# EAGLE design MagnetCard (EAGLE 9.4.2)
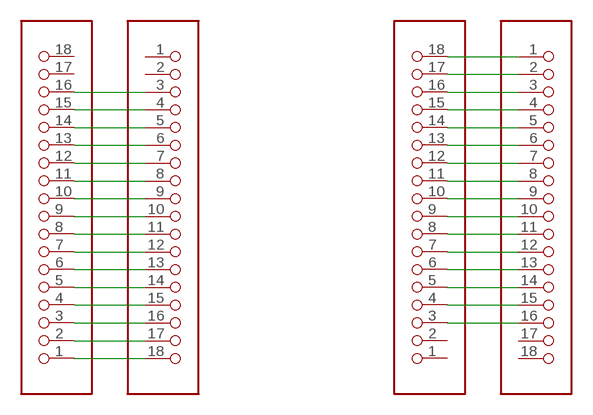
[diagram p0: schematic, sheet 1]

## Parts
U$1  18X1_CARD_PADLONG  [18X1_CARDPAD_LONG]
U$2  18X1_CARD_PADLONG  [18X1_CARDPAD_LONG]
U$3  18X1_CARD_PADLONG  [18X1_CARDPAD_LONG]
U$4  18X1_CARD_PADLONG  [18X1_CARDPAD_LONG]

## Nets
N$1: U$1.18 U$2.1
N$2: U$1.17 U$2.2
N$3: U$1.16 U$2.3
N$4: U$1.15 U$2.4
N$5: U$1.14 U$2.5
N$6: U$1.13 U$2.6
N$7: U$1.12 U$2.7
N$8: U$1.11 U$2.8
N$9: U$1.10 U$2.9
N$10: U$1.9 U$2.10
N$11: U$1.8 U$2.11
N$12: U$1.7 U$2.12
N$13: U$1.6 U$2.13
N$14: U$1.5 U$2.14
N$15: U$1.4 U$2.15
N$16: U$1.3 U$2.16
N$17: U$3.16 U$4.3
N$18: U$3.15 U$4.4
N$19: U$3.14 U$4.5
N$20: U$3.13 U$4.6
N$21: U$3.12 U$4.7
N$22: U$3.11 U$4.8
N$23: U$3.10 U$4.9
N$24: U$3.9 U$4.10
N$25: U$3.8 U$4.11
N$26: U$3.7 U$4.12
N$27: U$3.6 U$4.13
N$28: U$3.5 U$4.14
N$29: U$3.4 U$4.15
N$30: U$3.3 U$4.16
N$31: U$3.2 U$4.17
N$32: U$3.1 U$4.18
Unconnected: U$1.1 U$1.2 U$2.17 U$2.18 U$3.17 U$3.18 U$4.1 U$4.2

## Library data of the parts
U$1-U$4 = EzerLonginus:18X1_CARD_PAD

## Board
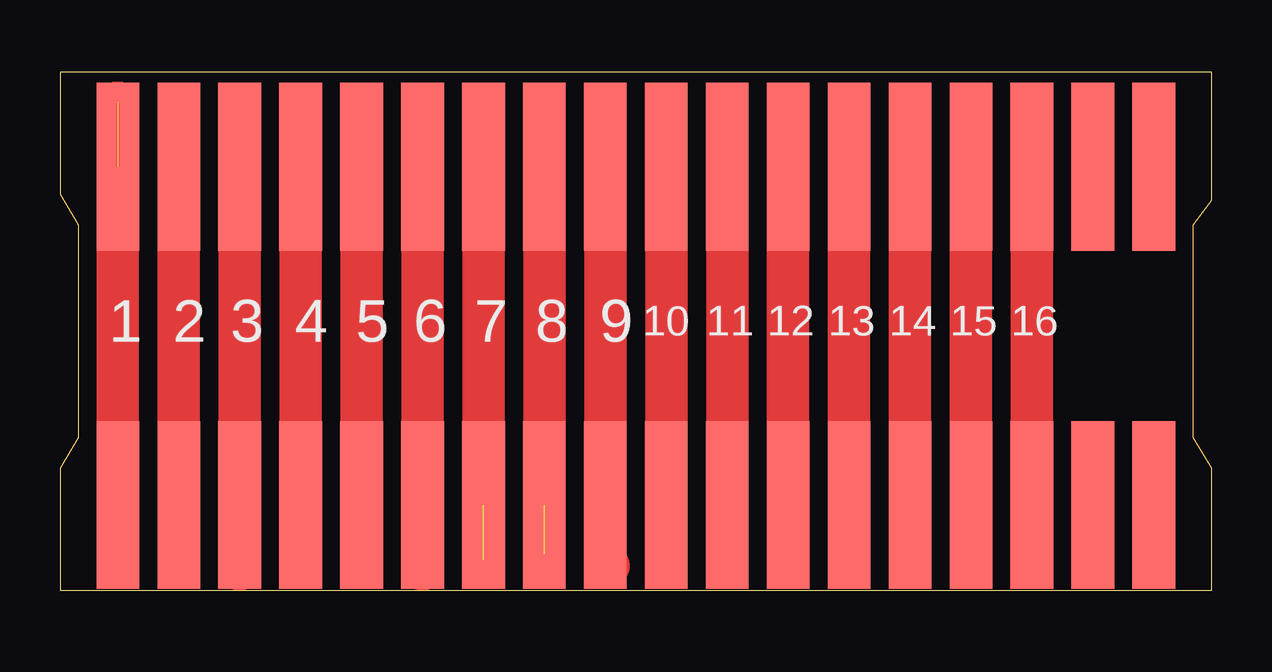
[diagram p1: board, top side]
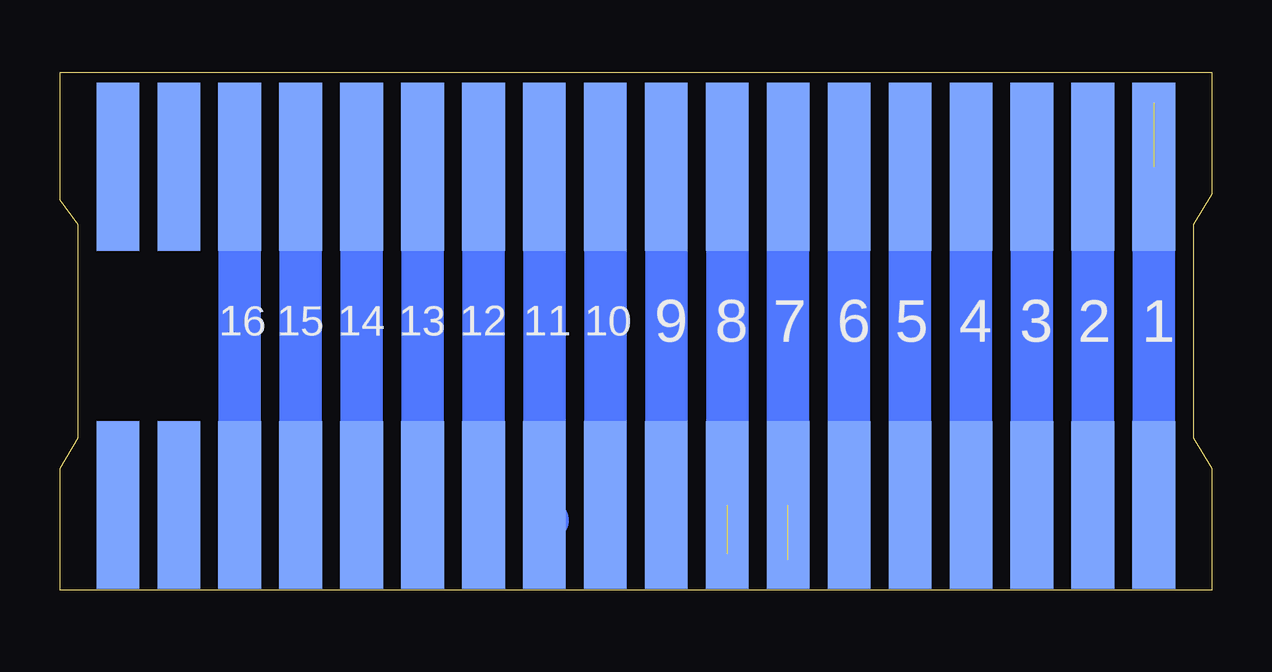
[diagram p2: board, bottom side, seen from below]

Size 48.01 x 21.59 mm. Coordinates in mm from the lower left corner, seen from the top.
Outline: 0,0 48.01,0 48.01,5.08 47.24,6.35 47.24,15.24 48.01,16.26 48.01,21.59 0,21.59 0,16.51 0.76,15.24 0.76,6.35 0,5.08 0,0
Copper layers (1*16): Top 0.035mm / dielectric 1.5mm / Bottom 0.035mm
Design rules "default *": minimum track width 6mil, minimum drill 0.35mm, track to track 6mil, track to pad 6mil, pad to pad 6mil, via to via 6mil, smd to smd 6mil, copper to edge 0mil, drill to drill 6mil, minimum pad ring 10mil, minimum via ring 8mil, stop-mask expansion 4mil, vias tented up to drill 0mil, thermal gap 10mil

### Footprints (pad centres in the part's own frame; a part is rotated, then mirrored left to right if it is on the bottom)
18X1_CARDPAD_LONG = smd 1.778 x 6.985: 1 -21.59,0; 2 -19.05,0; 3 -16.51,0; 4 -13.97,0; 5 -11.43,0; 6 -8.89,0; 7 -6.35,0; 8 -3.81,0; 9 -1.27,0; 10 1.27,0; 11 3.81,0; 12 6.35,0; 13 8.89,0; 14 11.43,0; 15 13.97,0; 16 16.51,0; 17 19.05,0; 18 21.59,0

### Placement (x,y rotation side)
U$1  24,17.65 180 top
U$2  24,3.56 0 top
U$3  24,17.65 180 bottom
U$4  24,3.56 0 bottom

### Tracks (layer width: path | path; a pad name or v marks a point on that pad's centre or on a via)
N$1  (1 unrouted)
  Top 1.778: U$2.1 2.41,20.32
N$2
  Top 1.778: 4.95,1.02 U$2.2 U$1.17
N$3
  Top 1.778: U$1.16 U$2.3 7.49,2.67 7.49,0.89
N$4
  Top 1.778: U$1.15 U$2.4 10.03,2.67 10.03,1.02
N$5
  Top 1.778: U$1.14 U$2.5 12.57,2.79 12.57,1.27
N$6
  Top 1.778: U$1.13 U$2.6 15.11,2.92 15.11,0.89
N$7  (1 unrouted)
  Top 1.778: U$1.12 17.65,1.27
N$8  (1 unrouted)
  Top 1.778: U$1.11 20.19,1.52
N$9
  Top 1.778: U$1.10 22.73,4.19 U$2.9 22.73,1.14 22.86,1.02
N$10
  Top 1.778: U$1.9 25.27,4.83 U$2.10 25.27,2.54
N$11
  Top 1.778: U$1.8 U$2.11
N$12
  Top 1.778: U$1.7 30.35,3.81 U$2.12 30.35,1.02
N$13
  Top 1.778: U$1.6 32.89,4.95 U$2.13 32.89,3.05
N$14
  Top 1.778: U$1.5 U$2.14
N$15
  Top 1.778: U$1.4 U$2.15
N$16
  Top 1.778: U$1.3 U$2.16
N$17
  Bottom 1.778: U$3.16 U$4.3
N$18
  Bottom 1.778: U$3.15 U$4.4
N$19
  Bottom 1.778: U$4.5 35.43,13.84 35.43,16.64 U$3.14
N$20
  Bottom 1.778: U$3.13 32.89,7.87 32.89,5.08 U$4.6
N$21
  Bottom 1.778: U$3.12 U$4.7
N$22
  Bottom 1.778: U$3.11 27.81,5.71 U$4.8 27.81,3.05 27.69,2.92
N$23
  Bottom 1.778: U$3.10 25.27,5.71 U$4.9 25.27,2.29
N$24
  Bottom 1.778: U$3.9 22.73,4.7 U$4.10 22.73,2.92
N$25
  Bottom 1.778: U$3.8 20.19,4.45 U$4.11 20.19,2.67
N$26
  Bottom 1.778: U$4.12 17.65,16.26 U$3.7 17.65,18.16
N$27
  Bottom 1.778: U$3.6 U$4.13
N$28
  Bottom 1.778: U$3.5 U$4.14
N$29
  Bottom 1.778: U$4.15 U$3.4
N$30
  Bottom 1.778: U$3.3 U$4.16
N$31
  Bottom 1.778: U$3.2 4.95,4.7 U$4.17 4.95,2.29
N$32
  Bottom 1.778: U$3.1 U$4.18

### Text on the board
tPlace: 10 | 11 | 12 | 13 | 14 | 15 | 16 | 1 | 2 | 3 | 4 | 5 | 6 | 7 | 8 | 9
bPlace: 10 | 11 | 12 | 13 | 14 | 15 | 16 | 1 | 2 | 3 | 4 | 5 | 6 | 7 | 8 | 9